# Altium project RGB_Project.PrjPcb
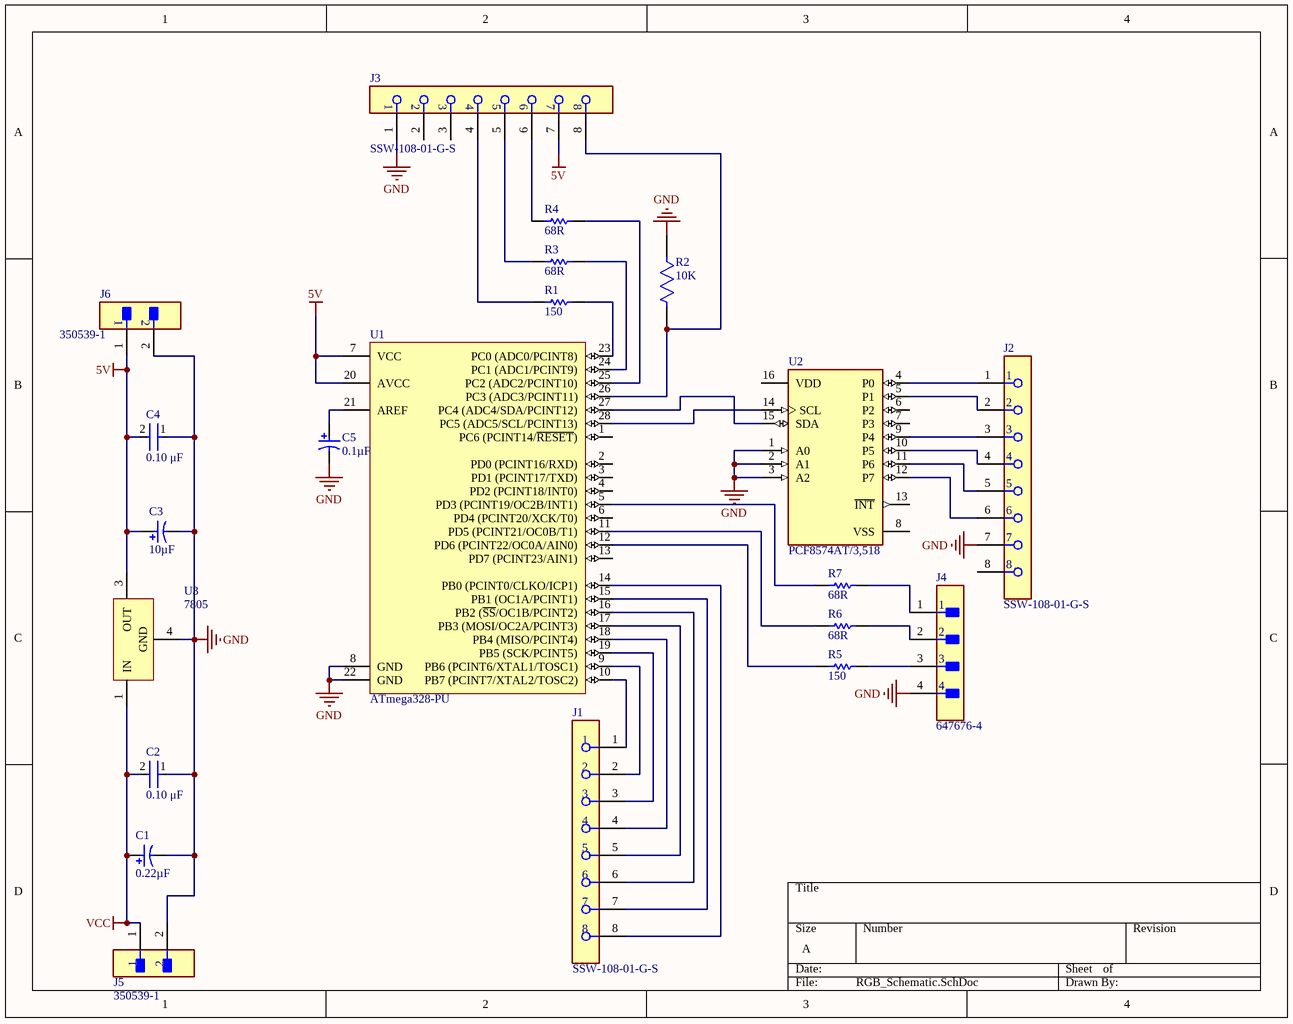
[diagram p0: RGB_Schematic.SchDoc]
1 sheet, 21 parts. Net scope: global (net labels, ports and power ports of the same name join across sheets).
Board file: RGB_PCB1PcbDoc.PcbDoc

## Sheet RGB_Schematic.SchDoc
size A; SheetNumber: 1; SheetTotal: 1

### Parts
C1  0.22µF  [PNSC-FP-V-D_V]
C2  0.10 μF  [FP-C1206C-EB-MFG]
C3  10µF  [PNSC-FP-V-D_V]
C4  0.10 μF  [FP-C1206C-EB-MFG]
C5  0.1µF  [PNSC-FP-V-D_V]
J1  SSW-108-01-G-S  [FP-SSW-108-01-G-S-MFG]
J2  SSW-108-01-G-S  [FP-SSW-108-01-G-S-MFG]
J3  SSW-108-01-G-S  [FP-SSW-108-01-G-S-MFG]
J4  647676-4  [FP-647676-4-MFG]
J5  350539-1  [FP-350539-1-MFG]
J6  350539-1  [FP-350539-1-MFG]
R1  150  [RESC3126X60X50ML10T20]
R2  10K  [FP-MCS0402-IPC_A]
R3  68R  [RESC1608X55X30LL20T20]
R4  68R  [RESC1608X55X30LL20T20]
R5  150  [RESC3126X60X50ML10T20]
R6  68R  [RESC1608X55X30LL20T20]
R7  68R  [RESC1608X55X30LL20T20]
U1  ATmega328-PU  [28P3]
U2  PCF8574AT/3,518  [FP-SOT162-1-MFG]
U3  7805  [TO-263_M]

### Nets
 5V: C3.1 C4.2 J3.7 J6.1 U1.7(VCC) U1.20(AVCC) U3.3(OUT)  [also labelled 5V]
GND: C1.2 C2.1 C3.2 C4.1 C5.2 J2.7 J3.1 J4.4 J5.2 J6.2 R2.1 U1.8(GND) U1.22(GND) U2.1(A0) U2.2(A1) U2.3(A2) U3.4(GND)
VCC: C1.1 C2.2 J5.1 U3.1(IN)
NetC5_1: C5.1 U1.21(AREF)
NetJ1_1: J1.1 U1.10(PB7_(PCINT7/XTAL2/TOSC2))
NetJ1_2: J1.2 U1.9(PB6_(PCINT6/XTAL1/TOSC1))
NetJ1_3: J1.3 U1.19(PB5_(SCK/PCINT5))
NetJ1_4: J1.4 U1.18(PB4_(MISO/PCINT4))
NetJ1_5: J1.5 U1.17(PB3_(MOSI/OC2A/PCINT3))
NetJ1_6: J1.6 U1.16(PB2_(~{SS}/OC1B/PCINT2))
NetJ1_7: J1.7 U1.15(PB1_(OC1A/PCINT1))
NetJ1_8: J1.8 U1.14(PB0_(PCINT0/CLKO/ICP1))
NetJ2_1: J2.1 U2.4(P0)
NetJ2_2: J2.2 U2.5(P1)
NetJ2_3: J2.3 U2.9(P4)
NetJ2_4: J2.4 U2.10(P5)
NetJ2_5: J2.5 U2.11(P6)
NetJ2_6: J2.6 U2.12(P7)
NetJ3_4: J3.4 R1.1
NetJ3_5: J3.5 R3.1
NetJ3_6: J3.6 R4.1
NetJ3_8: J3.8 R2.2 U1.26(PC3_(ADC3/PCINT11))
NetJ4_1: J4.1 R7.2
NetJ4_2: J4.2 R6.2
NetJ4_3: J4.3 R5.2
NetR1_2: R1.2 U1.23(PC0_(ADC0/PCINT8))
NetR3_2: R3.2 U1.24(PC1_(ADC1/PCINT9))
NetR4_2: R4.2 U1.25(PC2_(ADC2/PCINT10))
NetR5_1: R5.1 U1.12(PD6_(PCINT22/OC0A/AIN0))
NetR6_1: R6.1 U1.11(PD5_(PCINT21/OC0B/T1))
NetR7_1: R7.1 U1.5(PD3_(PCINT19/OC2B/INT1))
NetU1_27: U1.27(PC4_(ADC4/SDA/PCINT12)) U2.15(SDA)
NetU1_28: U1.28(PC5_(ADC5/SCL/PCINT13)) U2.14(SCL)

Not connected (* = marked no-connect by the designer): J2 8; J3 2 3; U1 1(PC6_(PCINT14/~{RESET})) 2(PD0_(PCINT16/RXD)) 3(PD1_(PCINT17/TXD)) 4(PD2_(PCINT18/INT0)) 6(PD4_(PCINT20/XCK/T0)) 13(PD7_(PCINT23/AIN1)); U2 6(P2) 7(P3) 8(VSS) 13(~{INT}) 16(VDD)

### Library data of the parts
C1 C3 C5 = CMP-2000-06216-1: Aluminum Electrolytic Capacitor, 47 uF, +/- 20%, 35 V, 2-Pin SMD (Size Code D), -55 to 105 degC, RoHS, Tape and Reel; Manufacturer: Panasonic; Lifetime@Temperature: 2000Hrs@105°C; Type: Can; Rated Voltage: 35V; Ripple Current: 300mA; ESR (Equivalent Series Resistance): 0.26O; Package Reference: FP-V-D; Package Description: 2-Pin Electrolytic Aluminum Capacitor, Body 6.6 x 6.6 mm; Datasheet URL: http://industrial.panasonic.com/cdbs/www-data/pdf/RDE0000/ABA0000C1184.pdf; Series: FP; Operating Temp Range: -55to+105°C; Operating Temp-Max: 105°C; Datasheet Version: 03/2016; Manufacturer URL: http://www.panasonic.com/; Package URL: http://industrial.panasonic.com/cdbs/www-data/pdf/RDE0000/DME0000COL48.pdf; Case Size/Dimension: Ø6.3x5.8mm; Mounting Technology: SurfaceMount
  C1: Capacitance: 0.22µF
  C3: Capacitance: 10µF
  C5: Capacitance: 0.1µF
C2 C4 = CMP-03020-000153-1: CAP CER 0.1UF 100V X7R 1206,C1206C104K1RACTU; Manufacturer: KEMET; Tolerance: 0.1; Description: C1206 0.10 μF X7R 10.00% 100 V; Material: Ceramic; Temperature Coefficient: 15%; Automotive Grade: Grade 0; Voltage Rating: 100 V; Value: 0.10 μF; Automotive: Yes; Ipc Land Pattern Name: CAPC320160X78; Device Class L1: Passive Components; ComponentLink2Description: Datasheet; Temperature Range Low: -55°C; Category: Cap; Octopart: https://octopart.com/c1206c104k1ractu-kemet-89521; Height: 0.88mm; Lead Free: Yes; Digikey Description: CAP CER 0.1UF 100V X7R 1206; Mouser Description: CAP CER 0.1UF 100V X7R 1206; Device Class L3: Ceramic Capacitors; Device Class L2: Capacitors; ComponentLink2URL: https://content.kemet.com/datasheets/KEM_C1007_X8R_ULTRA_150C_SMD.pdf; Temperature Range High: +150°C; Temperature Characteristic: X7R; Manufacturer Part Number: C1206C104K1RACTU; RoHS: TRUE; Capacitance: 0.10 μF; Package: C1206C-EB; Temperature: -55°C to +150°C
J1-J3 = CMP-1272-00001-2: CONN RCPT 8POS 0.1 GOLD PCB; Pitch: 2.54mm; Number of Positions: 8; Max Current Rating: 6.9A; Gender: Receptacle; Max Voltage Rating (AC): 550V; Contact Resistance: 10mR; Mating Cycles: 100; Connector Type: Socket; Series: SSW; Length: 20.83mm; Packaging: Bulk; Contact Material: Bronze; Color: Black; Housing Material: Polymer; Number of Rows: 1; REACH SVHC: No SVHC; Lead Free: Lead Free; Termination: Solder; Max Operating Temperature: 125°C; Depth: 2.41mm; Number of Contacts: 8; Min Operating Temperature: -55°C; Housing Color: Black; RoHS Compliant: Yes; Contact Plating: Gold; Radiation Hardening: No; Contact Type: Female Socket; Orientation: Vertical; Voltage Rating: 550V; Current Rating: 6.9A
J4 = CMP-03369-000065-1: CONN HEADER R/A 4POS 3.96MM; Manufacturer: TE; Conn Gender: Male; Voltage Rating: 250V; Description: 4 Position Single Row 3.96 mm Right Angle Header Unshrouded Male Pin Connector; Current Rating: 7.5A; Conn Orientation: Right Angle; Number Of Contacts: 4; Temperature: -25°C to +105°C; Temperature Range High: +105°C; ComponentLink2URL: https://www.te.com/commerce/DocumentDelivery/DDEController?Action=showdoc&DocId=Specification+Or+Standard%7F108-2297%7FB%7Fpdf%7FEnglish%7FENG_SS_108-2297_B_108-2297RevB.pdf%7F647676-6; Footprint Url: https://www.te.com/commerce/DocumentDelivery/DDEController?Action=showdoc&DocId=Customer+Drawing%7F647676%7FB1%7Fpdf%7FEnglish%7FENG_CD_647676_B1.pdf%7F647676-6; ComponentLink2Description: Datasheet; Number Of Rows: 1; Automotive: No; Lead Free: Yes; Device Class L3: unset; Manufacturer Part Number: 647676-4; Category: Conn; Contact Material: Tin; Device Class L1: Connectors; Height: 8.8mm; Mouser Description: 4 Position Single Row 3.96 mm Right Angle Header Unshrouded Male Pin Connector; Pitch: 3.96mm; Package: 647676-4; Octopart: https://octopart.com/647676-4-te+connectivity-41901901; RoHS: TRUE; Device Class L2: Headers and Wire Housings; Digikey Description: CONN HEADER R/A 4POS 3.96MM; Temperature Range Low: -25°C
J5 J6 = CMP-03369-000078-1: CONN HEADER VERT 2POS 5.08MM; Manufacturer: TE Connectivity; Current Rating: 12A; Conn Orientation: Vertical; Number Of Contacts: 2; Conn Gender: Male; Standoff Height: 0.025inch; Voltage Rating: 250V; Description: CONN HEADER 2POS VERT .200 TIN; Category: Conn; Height: 0.41inch; Device Class L3: unset; Number Of Rows: 1; Temperature: -55°C to +105°C; ComponentLink2URL: https://www.te.com/usa-en/product-350539-1.html?te_bu=Cor&te_type=other&te_campaign=oct_glo_cor-oct-global-oth-prtnr-fy19-oct-octo-buy-bom_sma-298_2&elqCampaignId=35216; Manufacturer Part Number: 350539-1; Automotive: No; Mouser Description: Pin & Socket Connectors CONN PCM 2 POS TIN; ComponentLink2Description: Datasheet; Lead Free: Yes; Device Class L1: Connectors; Device Class L2: Headers and Wire Housings; Octopart: https://octopart.com/350539-1-te+connectivity-46510628; Digikey Description: CONN HEADER VERT 2POS 5.08MM; RoHS: TRUE; Temperature Range Low: -55°C; Package: 350539-1; Temperature Range High: +105°C; Contact Material: Gold,Nickel; Pitch: 5.08mm
R1 R5 = CMP-2005-01727-1: RC1210JR-07150RL; Manufacturer: Yageo; Part Number: RC1210JR-07150RL
R2 = CMP-02407-001558-1: RES SMD 10K OHM 0.1% 1/10W 0402, MCS0402MD1002BE100; Resistance: 10kR; Temperature Coefficient: 25ppm/°C; Power Rating: 63mW; Voltage Rating: 50V; Height: 0.32mm; Lead Free: Lead Free; Max Operating Temperature: 155°C; Width: 0.5mm; Case Code (Metric): 1005; Composition: Thin Film; Case/Package: 0402; Length: 1mm; Tolerance: 0.1%; Weight: 2.1E-05oz; Case Code (Imperial): 0402; Contact Plating: Tin; Packaging: Tape and Reel; Min Operating Temperature: -55°C
R3 R4 R6 R7 = CMP-2000-00110-1: ERA3AEB680V; Manufacturer: Panasonic; Part Number: ERA3AEB680V
U1 = CMP-0095-00015-2: 8-bit AVR Microcontroller, 32KB Flash, 1KB EEPROM, 2KB SRAM, 28-pin PDIP, Industrial Grade (-40°C to 85°C); ComponentLink3Description: ATmega48A/48PA/88A/88PA/168A/168PA/328/328P Summary; RevisionNote: DatasheetVersion updated. URLs added.; DatasheetVersion: revD, May-2011; ComponentLink1URL: http://www.atmel.com/; PackageVersion: revB, Sep-2001; PackageDescription: 28-lead (0.300"/7.62mm Wide) Plastic Dual Inline Package (PDIP); PackageReference: 28P3; ComponentLink1Description: Manufacturer URL; ComponentLink2Description: ATmega48A/48PA/88A/88PA/168A/168PA/328/328P Datasheet; ComponentLink3URL: http://www.atmel.com/dyn/resources/prod_documents/8271S.pdf; ComponentLink2URL: http://www.atmel.com/dyn/resources/prod_documents/8271.pdf
U2 = CMP-10112-000003-1: IC I/O EXPANDER I2C 8B 16SOIC; Manufacturer: NXP Semiconductors; Interface: I2C,SMBus; Frequency: 100kHz; Nominal Supply Current: 40uA; Max Supply Voltage: 6V; Number Of I/Os: 8; Max Junction Temp: +125°C; Min Supply Voltage: 2.5V; Standoff Height: 0.1mm; RoHS: TRUE; Category: IC; Temperature: -40°C to +85°C; Device Class L3: I/O Expanders; ComponentLink2Description: Datasheet; ComponentLink2URL: https://www.nxp.com/docs/en/data-sheet/PCF8574_PCF8574A.pdf; Digikey Description: IC I/O EXPANDER I2C 8B 16SOIC; Ipc Land Pattern Name: SOIC127P1032X265-16; Mouser Description: PCF8574 Series 2.5 to 6V Remote 8-bit I/O Expander for I2C-bus -SOIC-16; Footprint Url: https://www.nxp.com/docs/en/package-information/SOT162-1.pdf; Lead Free: Yes; Device Class L2: Interface ICs; Ambient Temperature Range Low: -40°C; Temperature Range High: +85°C; Automotive: No; Manufacturer Part Number: PCF8574AT/3,518; Ambient Temperature Range High: +85°C; Height: 2.65mm; Package: SOT162-1; Temperature Range Low: -40°C; Octopart: https://octopart.com/pcf8574at%2F3%2C518-nxp+semiconductors-11541925; Device Class L1: Integrated Circuits (ICs)
U3 = CMP-0244-00213-1: Positive Voltage Regulator, 3-Pin D2PAK, Tape and Reel, L7805CD2T-TR; PackageReference: TO-263; ComponentLink2URL: http://www.st.com/internet/com/TECHNICAL_RESOURCES/TECHNICAL_LITERATURE/DATASHEET/CD00000444.pdf; PackageDescription: 3-Pin Transistor Outline Package 2.54 mm Pitch, 15.4 mm Lead Span (D2PAK); DatasheetVersion: 16/11/2011; ComponentLink2Description: Datasheet; ComponentLink1Description: Manufacturer URL; PackageVersion: 2011; ComponentLink1URL: http://www.st.com